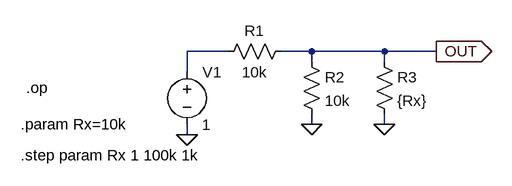
[diagram p0: schematic RR.asc]
RR.asc, the LTspice schematic file:
Version 4
SHEET 1 880 680
WIRE 128 112 64 112
WIRE 256 112 208 112
WIRE 368 112 256 112
WIRE 448 112 368 112
WIRE 256 128 256 112
WIRE 368 128 368 112
WIRE 64 144 64 112
WIRE 256 224 256 208
WIRE 368 224 368 208
WIRE 64 240 64 224
FLAG 256 224 0
FLAG 64 240 0
FLAG 448 112 OUT
IOPIN 448 112 Out
FLAG 368 224 0
SYMBOL res 224 96 R90
WINDOW 0 0 56 VBottom 2
WINDOW 3 32 56 VTop 2
SYMATTR InstName R1
SYMATTR Value 10k
SYMATTR SpiceLine pwr=1m
SYMBOL voltage 64 128 R0
WINDOW 3 23 97 Left 2
SYMATTR Value 1
SYMATTR Value2 AC 1 0
SYMATTR InstName V1
SYMBOL res 240 112 R0
SYMATTR InstName R2
SYMATTR Value 10k
SYMBOL res 352 112 R0
SYMATTR InstName R3
SYMATTR Value {Rx}
TEXT -192 224 Left 2 !.param Rx=10k
TEXT -192 272 Left 2 !.step param Rx 1 100k 1k
TEXT -184 168 Left 2 !.op

The netlist it stands for:
* RR.asc
R1 OUT N001 10k pwr=1m
V1 N001 0 1 AC 1 0
R2 OUT 0 10k
R3 OUT 0 {Rx}
.param Rx=10k
.step param Rx 1 100k 1k
.op
.backanno
.end

* Results of the author's LTspice run, read from the files saved beside the schematic
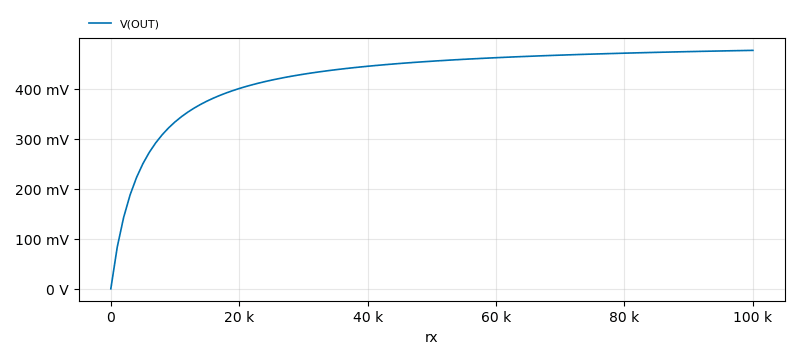
[diagram p1: Operating Point of RR.asc, plotted from the saved traces]
* Operating Point, 1 run:
*   V(OUT): 99.98 µV at rx=1 , 476.2 mV at rx=100 k, min 99.98 µV, max 476.2 mV